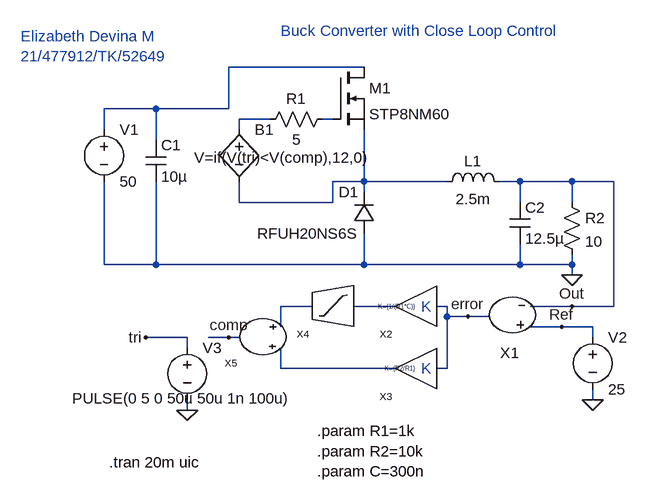
[diagram p0: schematic Elizabeth Devina M_477912_Buck close loop fix.asc]
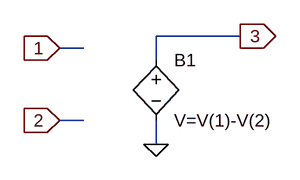
[diagram p1: sub-circuit substractor.asc]
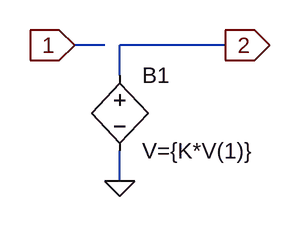
[diagram p2: sub-circuit gain.asc]
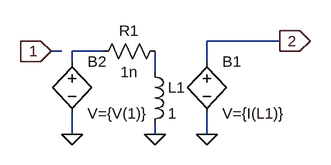
[diagram p3: sub-circuit integral.asc]
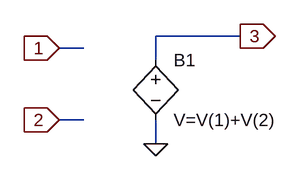
[diagram p4: sub-circuit adder.asc]
Elizabeth Devina M_477912_Buck close loop fix.asc, the LTspice schematic file:
Version 4
SHEET 1 880 680
WIRE 336 -16 128 -16
WIRE 16 48 -64 48
WIRE 128 48 128 -16
WIRE 128 48 16 48
WIRE 192 64 144 64
WIRE 288 64 272 64
WIRE -64 80 -64 48
WIRE 144 80 144 64
WIRE 16 96 16 48
WIRE 336 160 336 80
WIRE 336 160 288 160
WIRE 464 160 336 160
WIRE 576 160 544 160
WIRE 656 160 576 160
WIRE 720 160 656 160
WIRE 336 176 336 160
WIRE 144 192 144 160
WIRE 288 192 288 160
WIRE 288 192 144 192
WIRE 576 192 576 160
WIRE 656 192 656 160
WIRE -64 288 -64 160
WIRE 16 288 16 160
WIRE 16 288 -64 288
WIRE 336 288 336 240
WIRE 336 288 16 288
WIRE 576 288 576 256
WIRE 576 288 336 288
WIRE 656 288 656 272
WIRE 656 288 576 288
WIRE 656 304 656 288
WIRE 256 352 208 352
WIRE 384 352 320 352
WIRE 464 352 448 352
WIRE 656 352 592 352
WIRE 720 352 720 160
WIRE 720 352 656 352
WIRE 464 368 464 352
WIRE 496 368 464 368
WIRE 528 368 496 368
WIRE 208 384 208 352
WIRE 640 384 592 384
WIRE 688 384 640 384
WIRE 64 400 0 400
WIRE 128 400 96 400
WIRE 144 400 128 400
WIRE 688 400 688 384
WIRE 64 416 64 400
WIRE 208 448 208 416
WIRE 384 448 208 448
WIRE 464 448 464 368
WIRE 464 448 448 448
WIRE 688 496 688 480
WIRE 64 512 64 496
FLAG 656 304 0
FLAG 688 496 0
FLAG 64 512 0
FLAG 0 400 tri
FLAG 128 400 comp
FLAG 496 368 error
FLAG 656 352 Out
FLAG 640 384 Ref
SYMBOL voltage -64 64 R0
WINDOW 123 0 0 Left 0
WINDOW 39 0 0 Left 0
SYMATTR InstName V1
SYMATTR Value 50
SYMBOL cap 0 96 R0
SYMATTR InstName C1
SYMATTR Value 10µ
SYMBOL bv 144 64 R0
WINDOW 3 -69 59 Left 2
SYMATTR Value V=if(V(tri)<V(comp),12,0)
SYMATTR InstName B1
SYMBOL res 288 48 R90
WINDOW 0 0 56 VBottom 2
WINDOW 3 32 56 VTop 2
SYMATTR InstName R1
SYMATTR Value 5
SYMBOL nmos 288 -16 R0
SYMATTR InstName M1
SYMATTR Value STP8NM60
SYMBOL ind 448 176 R270
WINDOW 0 32 56 VTop 2
WINDOW 3 5 56 VBottom 2
SYMATTR InstName L1
SYMATTR Value 2.5m
SYMBOL diode 352 240 R180
WINDOW 0 24 64 Left 2
WINDOW 3 24 0 Left 2
SYMATTR InstName D1
SYMATTR Value RFUH20NS6S
SYMBOL cap 560 192 R0
SYMATTR InstName C2
SYMATTR Value 12.5µ
SYMBOL res 640 176 R0
SYMATTR InstName R2
SYMATTR Value 10
SYMBOL Substractor 560 368 R180
SYMATTR InstName X1
SYMBOL Gain 416 352 R180
WINDOW 39 0 0 Left 0
SYMATTR SpiceLine K={1/(R1*C)}
SYMATTR InstName X2
SYMBOL Gain 416 448 R180
WINDOW 39 0 0 Left 0
SYMATTR SpiceLine K={R2/R1}
SYMATTR InstName X3
SYMBOL Integral 288 352 R180
SYMATTR InstName X4
SYMBOL Adder 176 400 R180
SYMATTR InstName X5
SYMBOL voltage 688 384 R0
WINDOW 123 0 0 Left 0
WINDOW 39 0 0 Left 0
SYMATTR InstName V2
SYMATTR Value 25
SYMBOL voltage 64 400 R0
WINDOW 3 -177 94 Left 2
SYMATTR Value PULSE(0 5 0 50u 50u 1n 100u)
SYMATTR InstName V3
TEXT 264 544 Left 2 !.param R1=1k\n.param R2=10k\n.param C=300n
TEXT -56 592 Left 2 !.tran 20m uic
TEXT 424 352 Left 2 ;K
TEXT 424 448 Left 2 ;K
TEXT -192 -64 Left 2 ;Elizabeth Devina M\n21/477912/TK/52649
TEXT 208 -72 Left 2 ;Buck Converter with Close Loop Control

substractor.asc, the sub-circuit schematic file:
Version 4
SHEET 1 880 680
WIRE 272 112 160 112
WIRE 64 128 32 128
WIRE 160 144 160 112
WIRE 64 224 32 224
WIRE 160 256 160 224
FLAG 32 128 1
IOPIN 32 128 In
FLAG 32 224 2
IOPIN 32 224 In
FLAG 160 256 0
FLAG 272 112 3
IOPIN 272 112 Out
SYMBOL bv 160 128 R0
SYMATTR InstName B1
SYMATTR Value V=V(1)-V(2)

gain.asc, the sub-circuit schematic file:
Version 4
SHEET 1 880 680
WIRE 144 112 112 112
WIRE 272 112 160 112
WIRE 160 144 160 112
WIRE 160 256 160 224
FLAG 112 112 1
IOPIN 112 112 In
FLAG 160 256 0
FLAG 272 112 2
IOPIN 272 112 Out
SYMBOL bv 160 128 R0
SYMATTR InstName B1
SYMATTR Value V={K*V(1)}

integral.asc, the sub-circuit schematic file:
Version 4
SHEET 1 880 680
WIRE 272 112 160 112
WIRE -64 128 -80 128
WIRE 0 128 -48 128
WIRE -48 144 -48 128
WIRE 160 144 160 112
WIRE 80 160 80 128
WIRE -48 256 -48 224
WIRE 80 256 80 240
WIRE 160 256 160 224
FLAG 160 256 0
FLAG 272 112 2
IOPIN 272 112 Out
FLAG -80 128 1
IOPIN -80 128 In
FLAG 80 256 0
FLAG -48 256 0
SYMBOL bv 160 128 R0
SYMATTR InstName B1
SYMATTR Value V={I(L1)}
SYMBOL res 96 112 R90
WINDOW 0 0 56 VBottom 2
WINDOW 3 32 56 VTop 2
SYMATTR InstName R1
SYMATTR Value 1n
SYMBOL ind 64 144 R0
SYMATTR InstName L1
SYMATTR Value 1
SYMBOL bv -48 128 R0
SYMATTR InstName B2
SYMATTR Value V={V(1)}

adder.asc, the sub-circuit schematic file:
Version 4
SHEET 1 880 680
WIRE 272 112 160 112
WIRE 64 128 32 128
WIRE 160 144 160 112
WIRE 64 224 32 224
WIRE 160 256 160 224
FLAG 32 128 1
IOPIN 32 128 In
FLAG 32 224 2
IOPIN 32 224 In
FLAG 160 256 0
FLAG 272 112 3
IOPIN 272 112 Out
SYMBOL bv 160 128 R0
SYMATTR InstName B1
SYMATTR Value V=V(1)+V(2)

The netlist it stands for:
* Elizabeth Devina M_477912_Buck close loop fix.asc
V1 N001 0 50
C1 N001 0 10µ
B1 N002 N004 V=if(V(tri)<V(comp),12,0)
R1 N003 N002 5
M1 N001 N003 N004 N004 STP8NM60
L1 N004 Out 2.5m
D1 0 N004 RFUH20NS6S
C2 Out 0 12.5µ
R2 Out 0 10
XX1 Ref Out error substractor
XX2 error N006 gain params: K={1/(R1*C)}
XX3 error N007 gain params: K={R2/R1}
XX4 N006 N005 integral
XX5 N007 N005 comp adder
V2 Ref 0 25
V3 tri 0 PULSE(0 5 0 50u 50u 1n 100u)

* block symbol definitions
.subckt substractor 1 2 3
B1 3 0 V=V(1)-V(2)
.ends substractor

.subckt gain 1 2
B1 2 0 V={K*V(1)}
.ends gain

.subckt integral 1 2
B1 2 0 V={I(L1)}
R1 N002 N001 1n
L1 N002 0 1
B2 N001 0 V={V(1)}
.ends integral

.subckt adder 1 2 3
B1 3 0 V=V(1)+V(2)
.ends adder

.model D D
.lib standard.dio
.model NMOS NMOS
.model PMOS PMOS
.lib standard.mos
.param R1=1k
.param R2=10k
.param C=300n
.tran 20m uic
* K
* K
* Elizabeth Devina M
* 21/477912/TK/52649
* Buck Converter with Close Loop Control
.backanno
.end